# Altium schematic sheet RTerm.SchDoc: FPGA Motherboard for Digital Multiplexed Readout, McGill U.
size Letter; DocumentNumber: DfMUX13; Revision: Rev0, Prototype; SheetNumber: 13; SheetTotal: 27; PageSetup: Record=PageOptions|CenterHorizontal=True|CenterVertical=True|PrintScale=0.93|XCorrection=1.00|YCorrection=1.00|PrintKind=0|BorderSize=5000000|LeftOffset=0|BottomOffset=0|Orientation=2|PaperLength=1000|PaperWidth=1000|Scale=100|PaperSource=7|PrintQuality=-4|MediaType=1|DitherType=10|PaperKind=Letter|PrintScaleMode=1
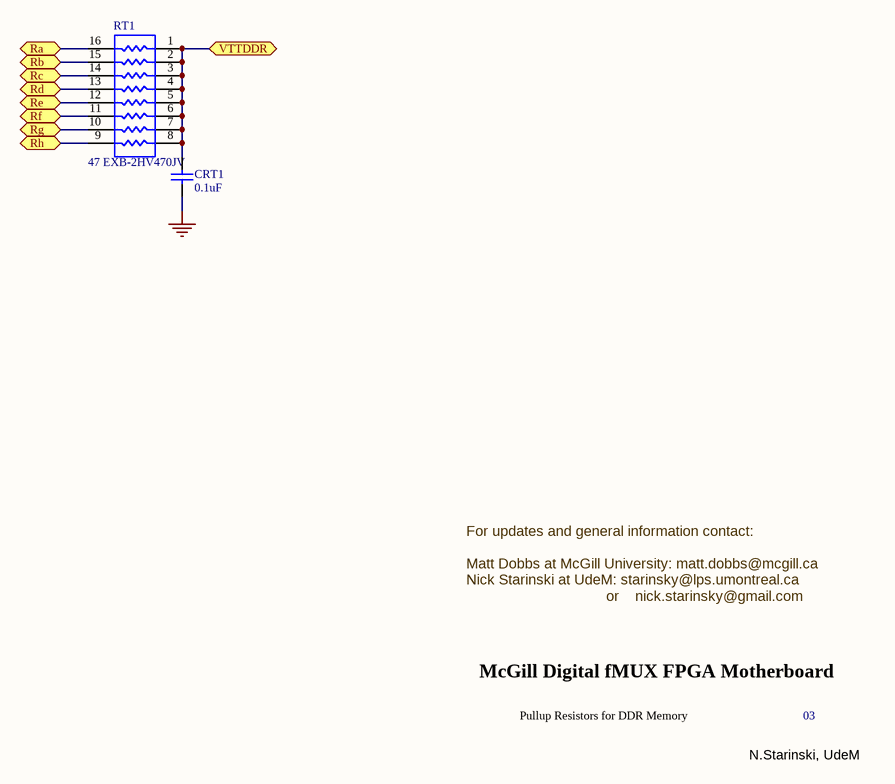
[diagram p0: RTerm.SchDoc]

## Parts
CRT1  0.1uF  [CC1608-0603]
RT1  47 EXB-2HV470JV  [0402_Array_2HV]

## Ports
Ra (bidir), Rb (bidir), Rc (bidir), Rd (bidir), Re (bidir), Rf (bidir), Rg (bidir), Rh (bidir), VTTDDR (bidir)

## Nets
GND: CRT1.1
Ra: RT1.16 ; port Ra
Rb: RT1.15 ; port Rb
Rc: RT1.14 ; port Rc
Rd: RT1.13 ; port Rd
Re: RT1.12 ; port Re
Rf: RT1.11 ; port Rf
Rg: RT1.10 ; port Rg
Rh: RT1.9 ; port Rh
VTTDDR: CRT1.2 RT1.1 RT1.2 RT1.3 RT1.4 RT1.5 RT1.6 RT1.7 RT1.8 ; port VTTDDR

## Notes on the sheet
- For updates and general information contact:
  Matt Dobbs at McGill University: matt.dobbs@mcgill.ca
  Nick Starinski at UdeM: starinsky@lps.umontreal.ca
  or    nick.starinsky@gmail.com
- McGill Digital fMUX FPGA Motherboard
- Pullup Resistors for DDR Memory
- 03
- N.Starinski, UdeM

## Library data of the parts
CRT1 = Cap Semi: Capacitor (Semiconductor SIM Model); Published: 8-Jun-2000; LatestRevisionDate: 17-Jul-2002; LatestRevisionNote: Re-released for DXP Platform.; PackageReference: C1206; Publisher: Altium Limited
RT1 = Res Pack3: Isolated Resistor Network; Published: 24-Mar-1999; LatestRevisionDate: 17-Jul-2002; LatestRevisionNote: Re-released for DXP Platform.; Publisher: Altium Limited